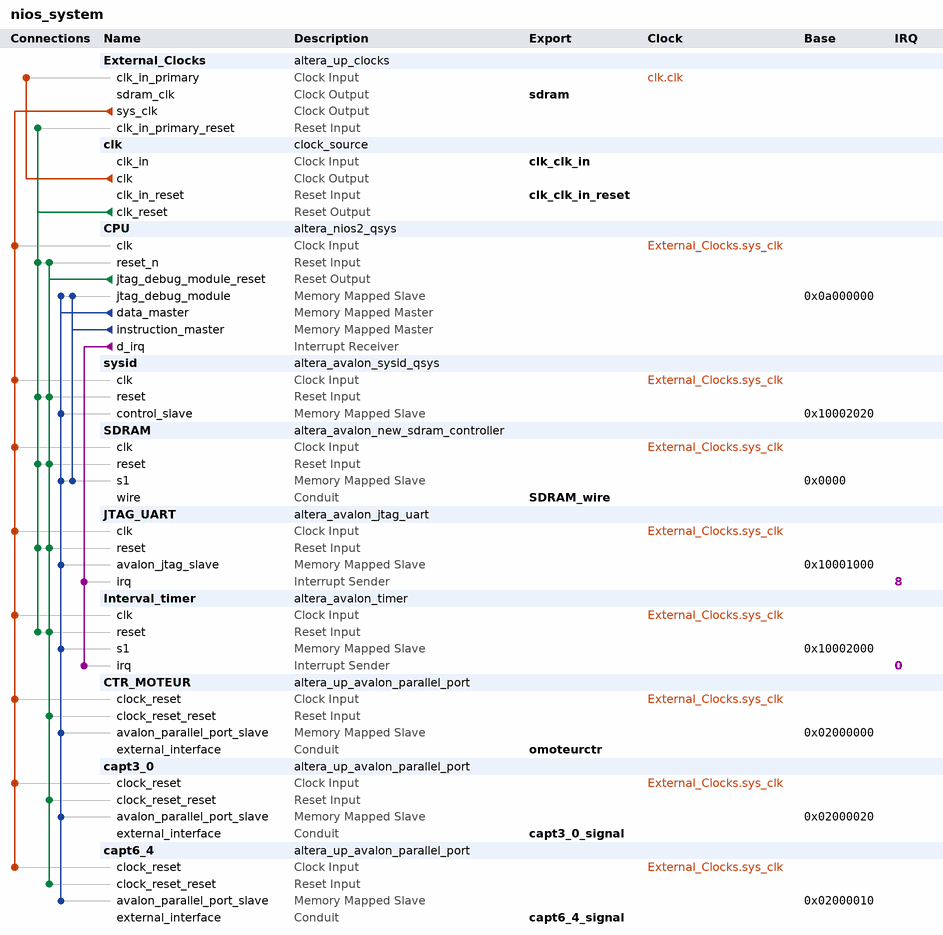
[diagram p0: system contents]
# Platform Designer (Qsys) system nios_system, Cyclone IV E EP4CE22F17C6
# Parameters at their usual value, and those the tool derives, are not listed.
package require -exact qsys 13.0
create_system nios_system
set_project_property DEVICE_FAMILY {Cyclone IV E}
set_project_property DEVICE EP4CE22F17C6

add_instance External_Clocks altera_up_clocks 13.0
set_instance_parameter_value External_Clocks board DE0-Nano
set_instance_parameter_value External_Clocks vga_clk false
set_instance_parameter_value External_Clocks audio_clk true
set_instance_parameter_value External_Clocks audio_clk_freq 12.288

add_instance clk clock_source 13.0
set_instance_parameter_value clk clockFrequency 50000000

add_instance CPU altera_nios2_qsys 13.0
set_instance_parameter_value CPU muldiv_divider true
set_instance_parameter_value CPU resetSlave SDRAM.s1
set_instance_parameter_value CPU exceptionSlave SDRAM.s1
set_instance_parameter_value CPU breakSlave CPU.jtag_debug_module
set_instance_parameter_value CPU mmu_processIDNumBits 10
set_instance_parameter_value CPU impl Fast
set_instance_parameter_value CPU icache_size 2048
set_instance_parameter_value CPU debug_level Level2
set_instance_parameter_value CPU dcache_size 0
set_instance_parameter_value CPU dcache_lineSize 4

add_instance sysid altera_avalon_sysid_qsys 13.0
set_instance_parameter_value sysid id 0

add_instance SDRAM altera_avalon_new_sdram_controller 13.0.1.99.2
set_instance_parameter_value SDRAM TAC 5.5
set_instance_parameter_value SDRAM TRCD 20.0
set_instance_parameter_value SDRAM TRP 20.0
set_instance_parameter_value SDRAM casLatency 3
set_instance_parameter_value SDRAM columnWidth 9
set_instance_parameter_value SDRAM dataWidth 16
set_instance_parameter_value SDRAM generateSimulationModel true
set_instance_parameter_value SDRAM model custom
set_instance_parameter_value SDRAM numberOfBanks 4
set_instance_parameter_value SDRAM numberOfChipSelects 1
set_instance_parameter_value SDRAM powerUpDelay 100.0
set_instance_parameter_value SDRAM refreshPeriod 15.625
set_instance_parameter_value SDRAM rowWidth 13

add_instance JTAG_UART altera_avalon_jtag_uart 13.0.1.99.2
set_instance_parameter_value JTAG_UART simInteractiveOptions INTERACTIVE_ASCII_OUTPUT

add_instance Interval_timer altera_avalon_timer 13.0.1.99.2
set_instance_parameter_value Interval_timer period 10
set_instance_parameter_value Interval_timer periodUnits SEC

add_instance CTR_MOTEUR altera_up_avalon_parallel_port 13.0
set_instance_parameter_value CTR_MOTEUR board DE0-Nano
set_instance_parameter_value CTR_MOTEUR custom_port true
set_instance_parameter_value CTR_MOTEUR preset Pushbuttons
set_instance_parameter_value CTR_MOTEUR capture false
set_instance_parameter_value CTR_MOTEUR edge Rising
set_instance_parameter_value CTR_MOTEUR irq false

add_instance capt3_0 altera_up_avalon_parallel_port 13.0
set_instance_parameter_value capt3_0 board DE0-Nano
set_instance_parameter_value capt3_0 custom_port true
set_instance_parameter_value capt3_0 preset Pushbuttons
set_instance_parameter_value capt3_0 capture false
set_instance_parameter_value capt3_0 edge Rising
set_instance_parameter_value capt3_0 irq false

add_instance capt6_4 altera_up_avalon_parallel_port 13.0
set_instance_parameter_value capt6_4 board DE0-Nano
set_instance_parameter_value capt6_4 custom_port true
set_instance_parameter_value capt6_4 preset Pushbuttons
set_instance_parameter_value capt6_4 capture false
set_instance_parameter_value capt6_4 edge Rising
set_instance_parameter_value capt6_4 irq false

# connections
add_connection clk.clk External_Clocks.clk_in_primary clock
add_connection External_Clocks.sys_clk capt3_0.clock_reset clock
add_connection External_Clocks.sys_clk capt6_4.clock_reset clock
add_connection External_Clocks.sys_clk CPU.clk clock
add_connection External_Clocks.sys_clk CTR_MOTEUR.clock_reset clock
add_connection External_Clocks.sys_clk Interval_timer.clk clock
add_connection External_Clocks.sys_clk JTAG_UART.clk clock
add_connection External_Clocks.sys_clk SDRAM.clk clock
add_connection External_Clocks.sys_clk sysid.clk clock
add_connection clk.clk_reset CPU.reset_n reset
add_connection clk.clk_reset External_Clocks.clk_in_primary_reset reset
add_connection clk.clk_reset Interval_timer.reset reset
add_connection clk.clk_reset JTAG_UART.reset reset
add_connection clk.clk_reset SDRAM.reset reset
add_connection clk.clk_reset sysid.reset reset
add_connection CPU.jtag_debug_module_reset capt3_0.clock_reset_reset reset
add_connection CPU.jtag_debug_module_reset capt6_4.clock_reset_reset reset
add_connection CPU.jtag_debug_module_reset CPU.reset_n reset
add_connection CPU.jtag_debug_module_reset CTR_MOTEUR.clock_reset_reset reset
add_connection CPU.jtag_debug_module_reset Interval_timer.reset reset
add_connection CPU.jtag_debug_module_reset JTAG_UART.reset reset
add_connection CPU.jtag_debug_module_reset SDRAM.reset reset
add_connection CPU.jtag_debug_module_reset sysid.reset reset
add_connection CPU.data_master capt3_0.avalon_parallel_port_slave avalon
set_connection_parameter_value CPU.data_master/capt3_0.avalon_parallel_port_slave baseAddress 0x02000020
add_connection CPU.data_master capt6_4.avalon_parallel_port_slave avalon
set_connection_parameter_value CPU.data_master/capt6_4.avalon_parallel_port_slave baseAddress 0x02000010
add_connection CPU.data_master CPU.jtag_debug_module avalon
set_connection_parameter_value CPU.data_master/CPU.jtag_debug_module baseAddress 0x0a000000
add_connection CPU.data_master CTR_MOTEUR.avalon_parallel_port_slave avalon
set_connection_parameter_value CPU.data_master/CTR_MOTEUR.avalon_parallel_port_slave baseAddress 0x02000000
add_connection CPU.data_master Interval_timer.s1 avalon
set_connection_parameter_value CPU.data_master/Interval_timer.s1 baseAddress 0x10002000
add_connection CPU.data_master JTAG_UART.avalon_jtag_slave avalon
set_connection_parameter_value CPU.data_master/JTAG_UART.avalon_jtag_slave baseAddress 0x10001000
add_connection CPU.data_master SDRAM.s1 avalon
set_connection_parameter_value CPU.data_master/SDRAM.s1 baseAddress 0x0000
add_connection CPU.data_master sysid.control_slave avalon
set_connection_parameter_value CPU.data_master/sysid.control_slave baseAddress 0x10002020
add_connection CPU.instruction_master CPU.jtag_debug_module avalon
set_connection_parameter_value CPU.instruction_master/CPU.jtag_debug_module baseAddress 0x0a000000
add_connection CPU.instruction_master SDRAM.s1 avalon
set_connection_parameter_value CPU.instruction_master/SDRAM.s1 baseAddress 0x0000
add_connection CPU.d_irq Interval_timer.irq interrupt
set_connection_parameter_value CPU.d_irq/Interval_timer.irq irqNumber 0
add_connection CPU.d_irq JTAG_UART.irq interrupt
set_connection_parameter_value CPU.d_irq/JTAG_UART.irq irqNumber 8

# exported interfaces
add_interface SDRAM_wire conduit end
set_interface_property SDRAM_wire EXPORT_OF SDRAM.wire
add_interface clk_clk_in_reset reset sink
set_interface_property clk_clk_in_reset EXPORT_OF clk.clk_in_reset
add_interface clk_clk_in clock sink
set_interface_property clk_clk_in EXPORT_OF clk.clk_in
add_interface sdram clock source
set_interface_property sdram EXPORT_OF External_Clocks.sdram_clk
add_interface omoteurctr conduit end
set_interface_property omoteurctr EXPORT_OF CTR_MOTEUR.external_interface
add_interface capt3_0_signal conduit end
set_interface_property capt3_0_signal EXPORT_OF capt3_0.external_interface
add_interface capt6_4_signal conduit end
set_interface_property capt6_4_signal EXPORT_OF capt6_4.external_interface

set_interconnect_requirement {$system} qsys_mm.clockCrossingAdapter HANDSHAKE
set_interconnect_requirement {$system} qsys_mm.maxAdditionalLatency 0

save_system nios_system.qsys
